# Altium schematic sheet Sheet1.SchDoc
size A4
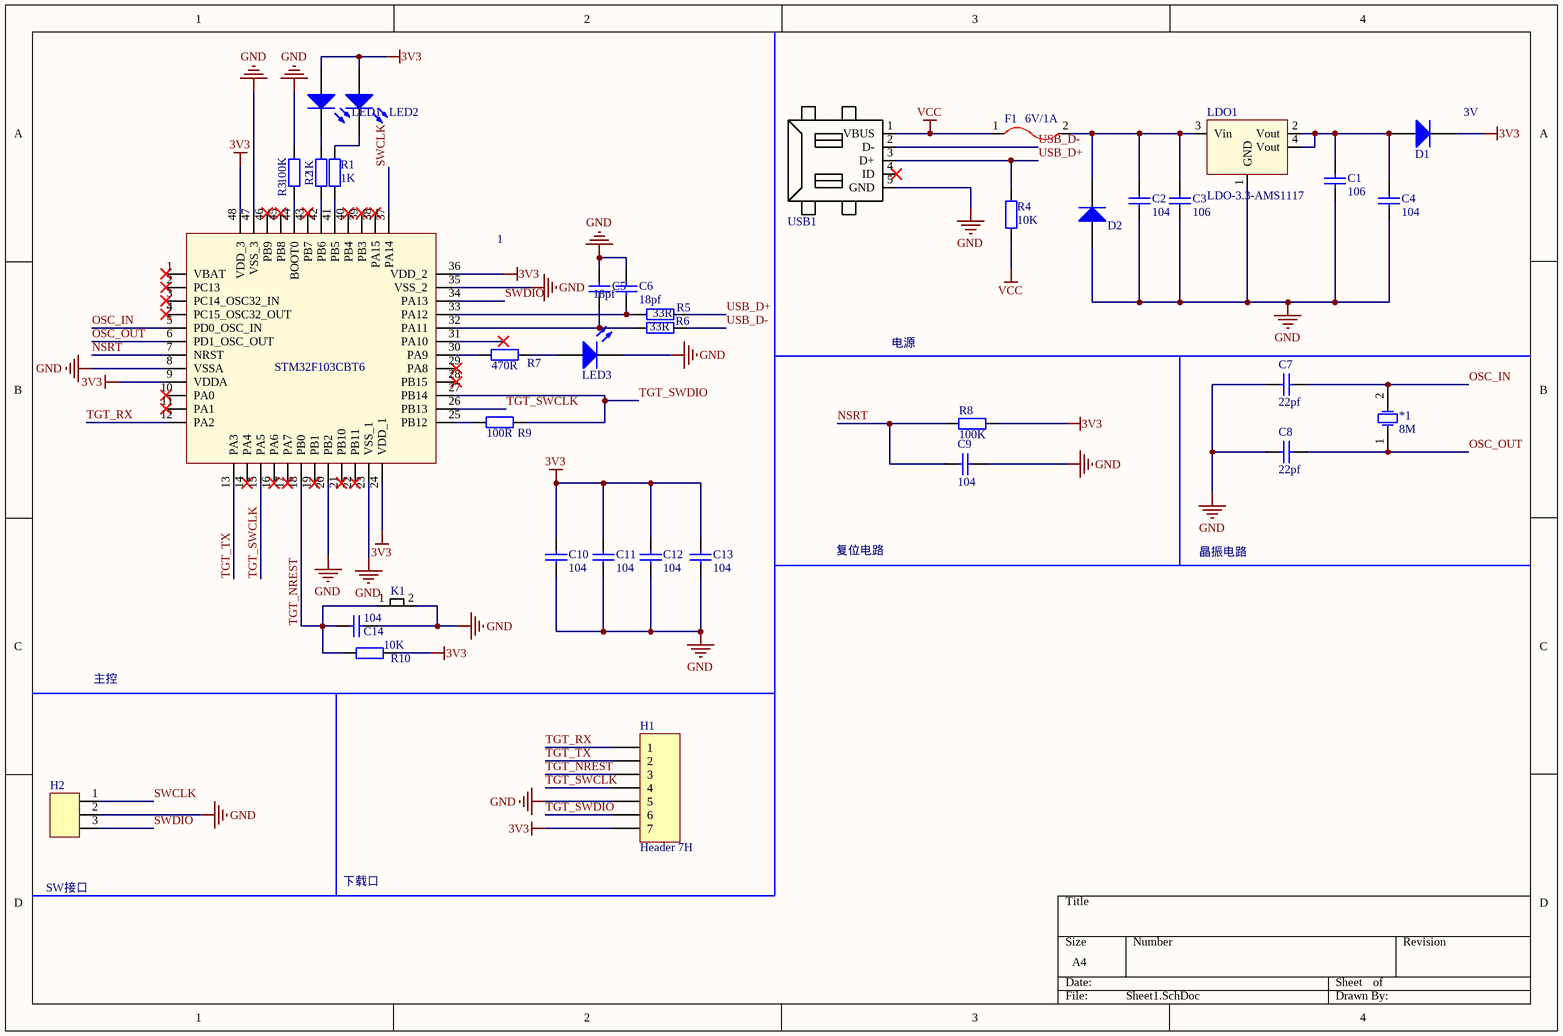
[diagram p0: Sheet1.SchDoc]

## Parts
1  STM32F103CBT6  [LQFP_48_7X7]  (value not drawn)
*1  8M  [XTAL_SMD_49S]
C1  106  [C_SOP_1206]
C2  104  [C_SOP_0603]
C3  106  [C_SOP_1206]
C4  104  [C_SOP_0603]
C5  18pf  [C_SOP_0603]
C6  18pf  [C_SOP_0603]
C7  22pf  [C_SOP_0603]
C8  22pf  [C_SOP_0603]
C9  104  [C_SOP_0603]
C10  104  [C_SOP_0603]
C11  104  [C_SOP_0603]
C12  104  [C_SOP_0603]
C13  104  [C_SOP_0603]
C14  104  [C_SOP_0603]
D1  1N4007  [LC-SMA(DO-214AC)_S5]  (value not drawn)
D2  1N4007  [LC-SMA(DO-214AC)_S5]  (value not drawn)
F1  6V/1A  [Fuse_0805]
H1  Header 7H  [Header 2.54X7]
H2  Header_1*3  [Header 2.54X3]  (value not drawn)
K1  KEY  [SW_PB_3X6]  (value not drawn)
LDO1  LDO-3.3-AMS1117  [SOT223_3]
LED1  LED  [LED_0603_R]  (value not drawn)
LED2  LED  [LED_0603_R]  (value not drawn)
LED3  LED  [LED_0603_R]  (value not drawn)
R1  1K  [R_SMD_0603]
R2  1K  [R_SMD_0603]
R3  100K  [R_SMD_0603]
R4  10K  [R_SMD_0603]
R5  33R  [R_SMD_0603]
R6  33R  [R_SMD_0603]
R7  470R  [R_SMD_0603]
R8  100K  [R_SMD_0603]
R9  100R  [R_SMD_0603]
R10  10K  [R_SMD_0603]
USB1  USB_AB  [USB_MINI_SMD]  (value not drawn)

## Nets
3V3: 1.9(VDDA) 1.24(VDD_1) 1.36(VDD_2) 1.48(VDD_3) C10.2 C11.2 C12.2 C13.2 D1.2(K) H1.7 LED1.1(A) LED2.1(A) R8.2 R10.2
GND: 1.8(VSSA) 1.20(PB2) 1.23(VSS_1) 1.35(VSS_2) 1.47(VSS_3) C1.1 C2.1 C3.1 C4.1 C5.1 C6.1 C7.1 C8.1 C9.2 C10.1 C11.1 C12.1 C13.1 C14.2 D2.1(A) H1.5 H2.2 K1.2 LDO1.1(GND) LED3.2(K) R3.2 USB1.5(GND)
VCC: F1.1(OUT) R4.1 USB1.1(VBUS)
NSRT: 1.7(NRST) C9.1 R8.1
OSC_IN: 1.5(PD0_OSC_IN) *1.2(OSC2) C7.2
OSC_OUT: 1.6(PD1_OSC_OUT) *1.1(OSC1) C8.2
SWCLK: 1.37(PA14) H2.1
SWDIO: 1.34(PA13) H2.3
TGT_NREST: 1.18(PB0) C14.1 H1.3 K1.1 R10.1
TGT_RX: 1.12(PA2) H1.1
TGT_SWCLK: 1.15(PA5) 1.26(PB13) H1.4
TGT_SWDIO: 1.27(PB14) H1.6 R9.2
TGT_TX: 1.13(PA3) H1.2
USB_D+: R4.2 R5.2 USB1.3(D+)
USB_D-: R6.2 USB1.2(D-)
Net1_25: 1.25(PB12) R9.1
Net1_30: 1.30(PA9) R7.1
Net1_32: 1.32(PA11) C5.2 R6.1
Net1_33: 1.33(PA12) C6.2 R5.1
Net1_41: 1.41(PB5) R1.1
Net1_42: 1.42(PB6) R2.1
Net1_44: 1.44(BOOT0) R3.1
NetC1_2: C1.2 C4.2 D1.1(A) LDO1.2(Vout) LDO1.4(Vout)
NetC2_2: C2.2 C3.2 D2.2(K) F1.2(OUT) LDO1.3(Vin)
NetLED1_2: LED1.2(K) R2.2
NetLED2_2: LED2.2(K) R1.2
NetLED3_1: LED3.1(A) R7.2

Not connected (* = marked no-connect by the designer): 1 1(VBAT)* 2(PC13)* 3(PC14_OSC32_IN)* 4(PC15_OSC32_OUT)* 10(PA0)* 11(PA1)* 14(PA4)* 16(PA6)* 17(PA7)* 19(PB1)* 21(PB10)* 22(PB11)* 28(PB15)* 29(PA8)* 31(PA10)* 38(PA15)* 39(PB3)* 40(PB4)* 43(PB7)* 45(PB8)* 46(PB9)*; USB1 4(ID)*

## Notes on the sheet
- (near D1) 3V
- 电源
- 复位电路
- 晶振电路
- 主控
- SW接口
- 下载口

## Library data of the parts
*1 = XTAL_SMD
C1-C14 = C_SMD
F1 = FUSE
H1 = Header 7H: Header, 7-Pin, Right Angle; LatestRevisionDate: 17-Jul-2002; LatestRevisionNote: Re-released for DXP Platform.; Publisher: Altium Limited
R1-R10 = R_SMD